# Altium schematic sheet IO.SchDoc
size A
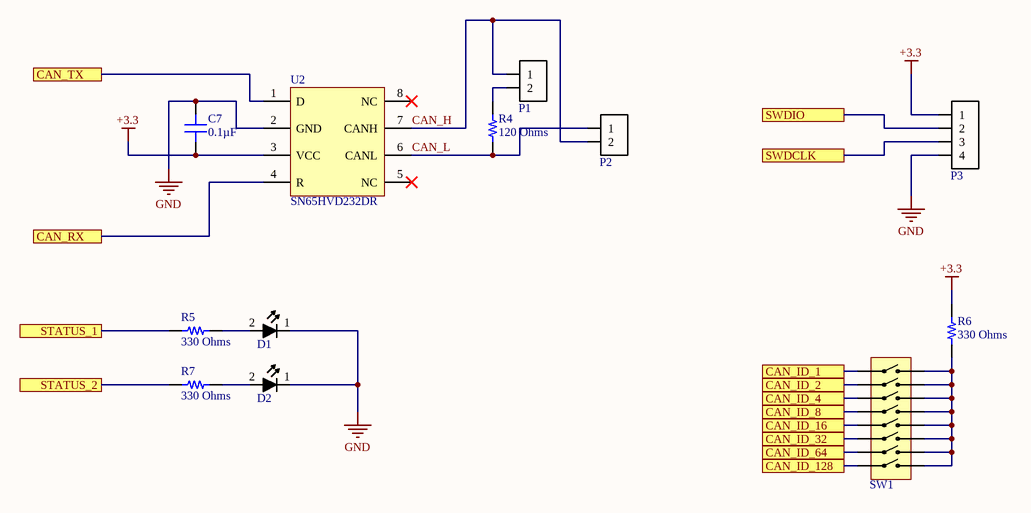
[diagram p0: IO.SchDoc]

## Parts
C7  0.1µF  [CAP 0805_2012]
D1  diode_4  [chip_0603_LED]  (value not drawn)
D2  diode_4  [chip_0603_LED]  (value not drawn)
P1  conn-2x1_0  [hddr_2x1_0]  (value not drawn)
P2  conn-2x1_0  [TERM_3.50MM_2x1_0]  (value not drawn)
P3  conn-4x1_0  [HDDR_4x1_0]  (value not drawn)
R4  120 Ohms  [RES 0805_2012]
R5  330 Ohms  [RES 0603_1608]
R6  330 Ohms  [RES 0603_1608]
R7  330 Ohms  [RES 0603_1608]
SW1  DIP_SW_8  [A6S-8104-H]  (value not drawn)
U2  Manufacturer PN: SN65HVD232DR  [SO-8]  (hidden comment: SN65HVD232)

## Ports
CAN_ID_1, CAN_ID_2, CAN_ID_4, CAN_ID_8, CAN_ID_16, CAN_ID_32, CAN_ID_64, CAN_ID_128, CAN_RX, CAN_TX, STATUS_1, STATUS_2, SWDCLK, SWDIO

## Nets
+3.3: C7.1 P3.1 R6.2 U2.3(VCC)
GND: C7.2 D1.1 D2.1 P3.4 U2.2(GND)
CAN_H: P1.1 P2.2 U2.7(CANH)
CAN_ID_1: SW1.1 ; port CAN_ID_1
CAN_ID_2: SW1.2 ; port CAN_ID_2
CAN_ID_4: SW1.3 ; port CAN_ID_4
CAN_ID_8: SW1.4 ; port CAN_ID_8
CAN_ID_16: SW1.5 ; port CAN_ID_16
CAN_ID_32: SW1.6 ; port CAN_ID_32
CAN_ID_64: SW1.7 ; port CAN_ID_64
CAN_ID_128: SW1.8 ; port CAN_ID_128
CAN_L: P2.1 R4.1 U2.6(CANL)
CAN_RX: U2.4(R) ; port CAN_RX
CAN_TX: U2.1(D) ; port CAN_TX
STATUS_1: R5.1 ; port STATUS_1
STATUS_2: R7.1 ; port STATUS_2
SWDCLK: P3.3 ; port SWDCLK
SWDIO: P3.2 ; port SWDIO
NetD1_2: D1.2 R5.2
NetD2_2: D2.2 R7.2
NetP1_2: P1.2 R4.2
NetR6_1: R6.1 SW1.9 SW1.10 SW1.11 SW1.12 SW1.13 SW1.14 SW1.15 SW1.16

Not connected (* = marked no-connect by the designer): U2 5(NC)* 8(NC)*

## Library data of the parts
C7 = C0805X104K5RAC3316: CAP CER 0805 0.1UF 50V X7R; Manufacturer: KEMET; Tolerance: ±10%; Part Number: C0805X104K5RAC3316; Value: 0.1µF; Applications: Automotive, Boardflex Sensitive; Capacitance: 0.1µF; ComponentLink1Description: Datasheet; ComponentLink1URL: https://api.kemet.com/component-edge/download/datasheet/C0805X104K5RAC3316.pdf; ComponentLink2Description: DigiKey Link; ComponentLink2URL: http://digikey.com/product-detail/en/kemet/C0805X104K5RAC3316/399-C0805X104K5RAC3316CT-ND/10315823; Device Package: 0805 (2012 Metric); Features: Soft Termination; LastUpdated: 9/2/2020 1:04:41 AM; Lifecycle Status: Active; Minimum Order: 1; Mounting Type: Surface Mount, MLCC; Operating Temperature: -55°C ~ 125°C; Package / Case: 0805 (2012 Metric); Packaging: TapeAndReel; PartId: 2769; Part Status: Active; Price: 0.08; Ratings: AEC-Q200; Series: SMD Auto X7R VW80808; Size / Dimension: 0.079" L x 0.049" W (2.00mm x 1.25mm); Supplier 1: DigiKey; Supplier Part Number 1: 399-C0805X104K5RAC3316CT-ND; Temperature Coefficient: X7R; Thickness (Max): 0.047" (1.20mm); Voltage - Rated: 50V
D1 D2 = DIO-00049: LED, Blue, 0603, Low current, HELI2 Series; Manufacturer: Kingbright; Manufacturer PN: APT1608LVBC/D; Forward Voltage: 2.65V; Reverse Breakdown Voltage: 5V; Power Rating: 120mW; Current Rating: 30mA; Part Number: DIO-00049; Type: LED; Cost: 0.58
P1 = CONN-00055: Header, 2x1, 0.1"; Manufacturer: Samtec; Manufacturer PN: TSW-102-07-F-S; Positions per level: 2; Levels: 1; Part Number: CONN-00055; Type: Header; Cost: 0.2
P2 = CONN-00023: Term Blk, 2 Pos, 8A, 3.5mm Pitch, Screwless; Manufacturer: Phoenix Contact; Manufacturer PN: 1861933; Positions per level: 2; Levels: 1; Current: 8; Part Number: CONN-00023; Type: Terminal Block; Cost: 0.79; Weight: 1.13
P3 = CONN-00029: Header 4x1, 0.1"; Positions per level: 4; Levels: 1; Part Number: CONN-00029; Type: Header
R4 = CRGCQ0805F120R: CRGCQ 0805 120R 1%; Manufacturer: TE Connectivity Passive Product; Power (Watts): 0.125W, 1/8W; Temperature Coefficient: ±100ppm/°C; Part Number: CRGCQ0805F120R; Value: 120 Ohms; ComponentLink1Description: Datasheet; ComponentLink1URL: https://www.te.com/commerce/DocumentDelivery/DDEController?Action=srchrtrv&DocNm=1773204-3&DocType=DS&DocLang=English; ComponentLink2Description: DigiKey Link; ComponentLink2URL: http://digikey.com/product-detail/en/te-connectivity-passive-product/CRGCQ0805F120R/A129738CT-ND/8577570; Composition: Thick Film; Device Package: 0805 (2012 Metric); Features: Automotive AEC-Q200, Moisture Resistant; Height - Seated (Max): 0.026" (0.65mm); LastUpdated: 9/2/2020 1:14:36 AM; Lifecycle Status: Active; Minimum Order: 1; Number of Terminations: 2; Operating Temperature: -55°C ~ 155°C; Package / Case: 0805 (2012 Metric); Packaging: TapeAndReel; PartId: 47663; Part Status: Active; Price: 0.01; Ratings: AEC-Q200; Resistance: 120 Ohms; Series: CRGCQ; Size / Dimension: 0.079" L x 0.049" W (2.00mm x 1.25mm); Supplier 1: DigiKey; Supplier Part Number 1: A129738CT-ND; Supplier Device Package: 0805; Tolerance: ±1%
R5-R7 = RK73B1JTTD331J: RES 330 OHM 5% 1/8W 0603; Manufacturer: KOA Speer Electronics, Inc.; Power (Watts): 0.125W, 1/8W; Temperature Coefficient: ±200ppm/°C; Part Number: RK73B1JTTD331J; Value: 330 Ohms; ComponentLink1Description: Datasheet; ComponentLink1URL: http://www.koaspeer.com/catimages/Products/RK73B/RK73B.pdf; ComponentLink2Description: DigiKey Link; ComponentLink2URL: http://digikey.com/product-detail/en/koa-speer-electronics-inc/RK73B1JTTD331J/2019-RK73B1JTTD331JCT-ND/9846751; Composition: Thick Film; Device Package: 0603 (1608 Metric); Features: Automotive AEC-Q200, Moisture Resistant; Height - Seated (Max): 0.022" (0.55mm); LastUpdated: 9/2/2020 1:10:22 AM; Lifecycle Status: Active; Minimum Order: 1; Number of Terminations: 2; Operating Temperature: -55°C ~ 155°C; Package / Case: 0603 (1608 Metric); Packaging: CutTape; PartId: 5985; Part Status: Active; Price: 0.10; Ratings: AEC-Q200; Resistance: 330 Ohms; Series: RK73B; Size / Dimension: 0.063" L x 0.031" W (1.60mm x 0.80mm); Supplier 1: DigiKey; Supplier Part Number 1: 2019-RK73B1JTTD331JCT-ND; Supplier Device Package: 0603; Tolerance: ±5%
SW1 = MISC-00045: DIP Switch, 8 Switches, SMD, 25mA, 24V; Manufacturer: Omron; Manufacturer PN: A6S-8104-H; Part Number: MISC-00045; Cost: 2.85
U2 = IFACE-00008: CANbus Transceiver, Single channel, SN65HVD232; Manufacturer: TI; Part Number: IFACE-00008; Cost: 2.01